# Altium schematic sheet Sensores_ADCs_Sheet.SchDoc: Sensores y ADCs
size 381 x 241 mm; Date: 13/10/2025; Author: Gerson T.& Lotfi D.; Organization: Universidad Distrital Francisco José de Caldas; DocumentNumber: 4; Revision: 1.0; SheetNumber: 4; SheetTotal: 5; Time: 19:25
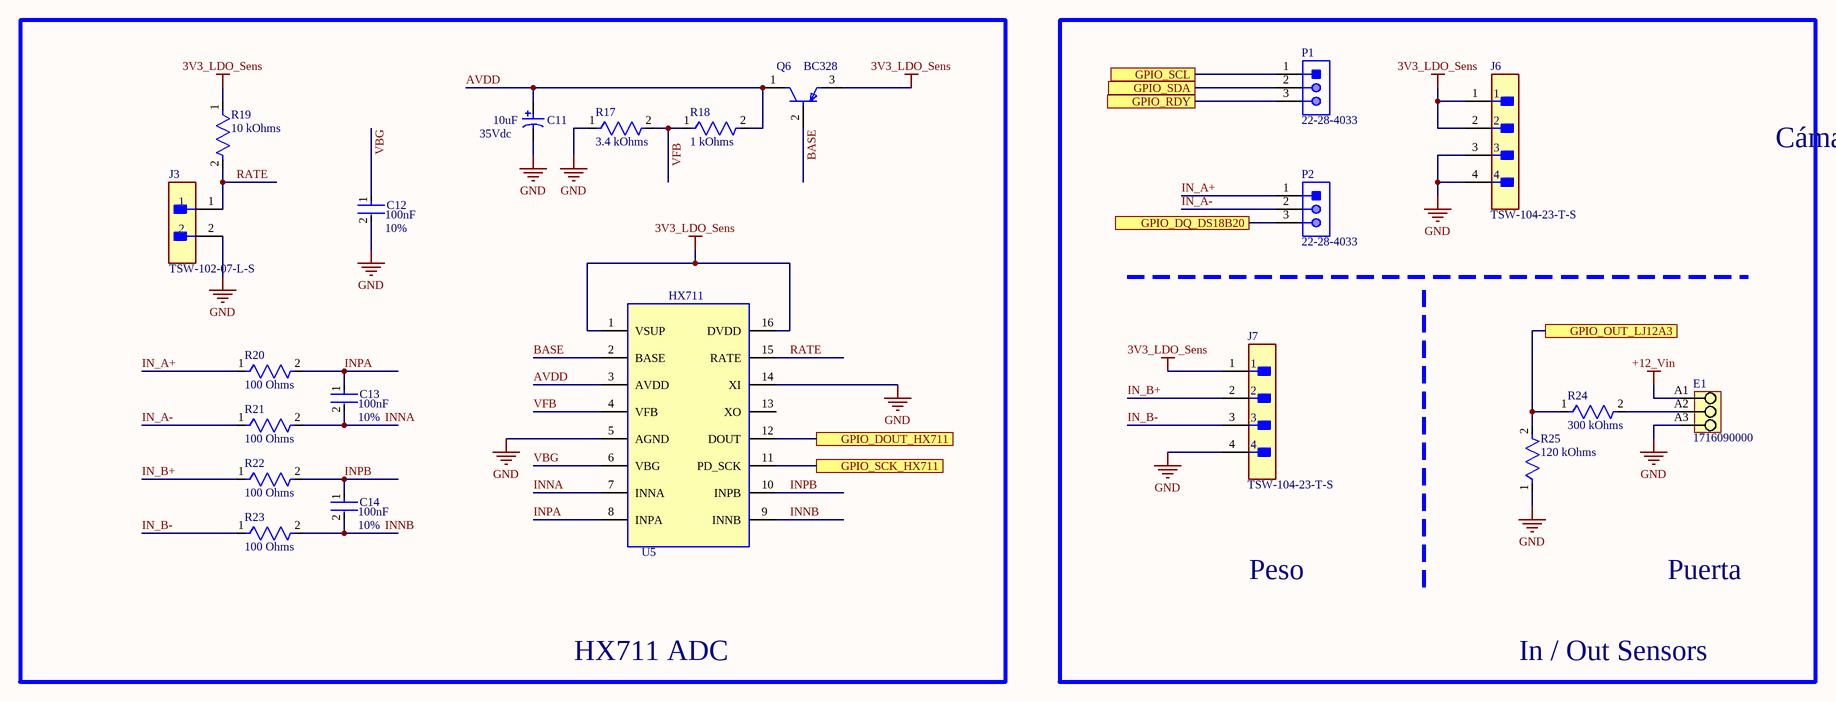
[diagram p0: Sensores_ADCs_Sheet.SchDoc]

## Parts
C11  Voltage: 35Vdc  Capacitance Value: 10uF  [KEMT-T352_E_V]  (hidden comment: T352E475K035AT)
C12  Tolerance: 10%  Capacitance: 100nF  [FP-RDE2M1-MFG]  (hidden comment: RDER72E104K2K1H03B)
C13  Tolerance: 10%  Capacitance: 100nF  [FP-RDE2M1-MFG]  (hidden comment: RDER72E104K2K1H03B)
C14  Tolerance: 10%  Capacitance: 100nF  [FP-RDE2M1-MFG]  (hidden comment: RDER72E104K2K1H03B)
E1  1716090000  [LM_5_08_90_03]
J3  TSW-102-07-L-S  [FP-TSW-102-07-L-S-MFG]
J6  TSW-104-23-T-S  [FP-TSW-104-23-T-S-MFG]
J7  TSW-104-23-T-S  [FP-TSW-104-23-T-S-MFG]
P1  22-28-4033  [MOLX-22-28-4033_V]
P2  22-28-4033  [MOLX-22-28-4033_V]
Q6  BC328  [TO-92]
R17  3.4 kOhms  [FP-FMP100-MFG]
R18  1 kOhms  [FP-FMP100-MFG]
R19  10 kOhms  [FP-FMP100-MFG]
R20  100 Ohms  [FP-FMP100-MFG]
R21  100 Ohms  [FP-FMP100-MFG]
R22  100 Ohms  [FP-FMP100-MFG]
R23  100 Ohms  [FP-FMP100-MFG]
R24  300 kOhms  [FP-FMP100-MFG]
R25  120 kOhms  [FP-FMP100-MFG]
U5  HX711  [SOP-16L (SOP127P600-8N)]

## Blocks framed on the sheet
HX711 ADC: C11-C14 J3 Q6 R17-R23 U5

## Ports
GPIO_DOUT_HX711 (see ESP32WROOM_Sheet[5A], ESP32WROOM_Sheet[5C]), GPIO_DQ_DS18B20 (see ESP32WROOM_Sheet[5A], ESP32WROOM_Sheet[5C]), GPIO_OUT_LJ12A3 (see ESP32WROOM_Sheet[5A], ESP32WROOM_Sheet[6C]), GPIO_RDY (see ESP32WROOM_Sheet[5B], ESP32WROOM_Sheet[5C]), GPIO_SCK_HX711 (see ESP32WROOM_Sheet[5B], ESP32WROOM_Sheet[5C]), GPIO_SCL (see ESP32WROOM_Sheet[5B], ESP32WROOM_Sheet[5D]), GPIO_SDA (see ESP32WROOM_Sheet[5B], ESP32WROOM_Sheet[5C])

## Nets
3V3_LDO_Sens: J6.1 J6.2 J7.1 Q6.3(C) R19.1 U5.1(VSUP) U5.16(DVDD)
+12_Vin: E1.A1
GND: C11.2 C12.2 E1.A3 J3.2 J6.3 J6.4 J7.4 R17.1 R25.1 U5.5(AGND) U5.14(XI)
AVDD: C11.1 Q6.1(E) R18.2 U5.3(AVDD)
BASE: Q6.2(B) U5.2(BASE)
GPIO_DOUT_HX711: U5.12(DOUT) ; port GPIO_DOUT_HX711
GPIO_DQ_DS18B20: P2.3 ; port GPIO_DQ_DS18B20
GPIO_OUT_LJ12A3: R24.1 R25.2 ; port GPIO_OUT_LJ12A3
GPIO_RDY: P1.3 ; port GPIO_RDY
GPIO_SCK_HX711: U5.11(PD_SCK) ; port GPIO_SCK_HX711
GPIO_SCL: P1.1 ; port GPIO_SCL
GPIO_SDA: P1.2 ; port GPIO_SDA
IN_A+: P2.1 R20.1
IN_A-: P2.2 R21.1
IN_B+: J7.2 R22.1
IN_B-: J7.3 R23.1
INNA: C13.2 R21.2 U5.7(INNA)
INNB: C14.2 R23.2 U5.9(INNB)
INPA: C13.1 R20.2 U5.8(INPA)
INPB: C14.1 R22.2 U5.10(INPB)
RATE: J3.1 R19.2 U5.15(RATE)
VBG: C12.1 U5.6(VBG)
VFB: R17.2 R18.1 U5.4(VFB)
NetE1_A2: E1.A2 R24.2

Not connected (* = marked no-connect by the designer): U5 13(XO)

## Notes on the sheet
- Cámara de gases
- Peso
- Puerta
- In / Out Sensors

## Library data of the parts
C11 = CMP-2000-07185-1: Capacitor, Tantalum, Radial, Solid Tantalum, Conformal, Dipped, 4.7 uF, +/- 10%, 35 V, -55 to 125 degC, 2-Pin THD (T352), RoHS, Bulk; Manufacturer: KEMET; Product Height: 11.7(Max)mm; Lead Pitch For Radial: 5.08mm; Product Diameter: 5.5(Max)mm; Voltage Rating DC: 35V; Package Description: 2-Pin Through Hole Device, Body 5.5 x 0.5 mm, Height 11.7 mm; Manufacturer URL: http://www.kemet.com/; Operating Temperature: -55to125°C; Packaging: Bulk; Category: CapacitorTantalumSolidRadial; Case Style: Dipped; PartNumber: T352E475K035AT; Maximum Operating Temperature: 125°C; Tolerance: 10%; Minimum Operating Temperature: -55°C; Mounting Technology: ThroughHole; Package Reference: T352; Datasheet Version: 05/2016; Datasheet URL: http://capacitoredge.kemet.com/capedge2/DataSheet/Datasheet-T352E475K035AT.pdf?pn=T352E475K035AT; Package URL: http://capacitoredge.kemet.com/capedge2/DataSheet/Datasheet-T352E475K035AT.pdf?pn=T352E475K035AT
C12-C14 = CMP-06035-020184-1: Ceramic Capacitor 100nF ±10% 250V X7R Radial; Lead/Base Style: Kinked; Lead Diameter: 0.5mm; Lead Pitch: 0.197inch; Dielectric: X7R; Mount: Through Hole; Resistor Type: Ceramic; Height: 4mm; Width: 0.124inch; Length: 5.5mm; Case/Package: Radial; Packaging: Bulk; Max Operating Temperature: 125°C; Voltage Rating (DC): 250V; Package Quantity: 500; Min Operating Temperature: -55°C; Voltage Rating: 250V; Termination: Radial; Height - Seated (Max): 0.236inch; Lead Free: Lead Free
E1 = CMP-1559-01768-1: OMNIMATE Signal - series LM; Manufacturer: Weidmueller; Contact_surface: tinned; Pitch_mm: 5,08 mm; Solder_pin_length_mm: 3,5 mm; Contact_material: Cu-Leg; Wire_cross_section_AWG_min_UL_1059: AWG 24; Solid_min_H05_07_V_U: 0,2 mm²; Insulating_material: Wemid (PA); Solid_max_H05_07_V_U: 2,5 mm²; Pitch_inch: 0,2 inch; Wire_cross_section_AWG_max_UL_1059: AWG 14; UL_94_flammability_rating: V-0; No_of_poles: 3; Rated_voltage_use_group_B_UL_1059: 300 V; Mounting_onto_the_PCB: Solder connection; Side_termination_characteristic: closed side; Short_text_for_material: LM 5.08/03/90 3.5SN OR BX; Rated_current_use_group_B_UL_1059: 15 A; Rated_voltage_for_surge_voltage_class_pollution_degree_II_2: 630 V; Revision: V1; ComponentLink2URL: http://catalog.weidmueller.com/catalog/Start.do?localeId=en&ObjectID=1716090000; Colour: Orange; PackageReference: LM_5_08_90_03; ComponentLink1Description: Manufacturer URL; ComponentLink2Description: URL Link1; ComponentLink1URL: http://www.weidmueller.com/; Qty: 500 PCS; PartNumber: 1716090000; Packaging: Box
J3 = CMP-02766-001428-1: CONN HEADER VERT 2POS 2.54MM; Voltage Rating: 550V; Current Rating: 7.6A; Gender: Male; Number of Contacts: 2; Connector Type: Male Pin; Radiation Hardening: No; Orientation: Straight; Contact Plating: Gold; Max Operating Temperature: 125°C; Mount: Through Hole; Package Quantity: 1; Number of Rows: 1; Housing Material: Polyester; RoHS Compliant: Yes; Length: 5.08mm; Max Voltage Rating (AC): 550V; Pitch: 2.54mm; Packaging: Bulk; Depth: 2.54mm; Termination: Solder; Min Operating Temperature: -55°C; Housing Color: Black; Lead Free: Lead Free; Color: Black; Number of Positions: 2; Width: 2.54mm; Max Current Rating: 7.6A; REACH SVHC: No SVHC; Contact Material: Bronze; Contact Mating Length: 0.23inch; Series: TSW; Contact Type: Male Pin
J6 J7 = CMP-02766-001388-1: CONN HEADER VERT 4POS 2.54MM; Number of Contacts: 4; Gender: Male; Connector Type: Male Pin; Max Voltage Rating (AC): 550V; Max Current Rating: 7.6A; Radiation Hardening: No; Lead Free: Lead Free; RoHS Compliant: Yes; Contact Material: Bronze; Number of Positions: 4; Housing Color: Black; Min Operating Temperature: -55°C; Mount: Through Hole; Number of Rows: 1; Orientation: Straight; Contact Mating Length: 0.23inch; Contact Type: Male Pin; REACH SVHC: No SVHC; Max Operating Temperature: 105°C; Color: Black; Pitch: 2.54mm; Length: 10.16mm; Series: TSW; Packaging: Bulk; Contact Plating: Tin; Package Quantity: 1; Termination: Solder; Housing Material: Polyester; Width: 2.54mm; Depth: 2.54mm
P1 P2 = CMP-1676-00001-5: Male Header, Pitch 2.54 mm, 1 x 3 Position, Height 8.38 mm, Tail Length 3.18 mm, RoHS, Bulk; Manufacturer: Molex; Rows: 1; Voltage Rating: 250 V; Current Rating: 4 A; Min Operating Temperature: 0 degC; Lead Pitch: 0.1 inch; Packaging: Bulk; Contact Finish: Gold; RoHSCompliant: true; Contact Material: Brass; PackageReference: 22-28-4033; REACH SVHC: Unknown; PackageDescription: Male Header, Pitch 2.54 mm, 1 x 3 Position, Height 8.38 mm, Tail Length 3.18 mm; ComponentLink2URL: http://www.molex.com/pdm_docs/sd/022284033_sd.pdf; Height: 8.38 mm; Mounting Technology: Through Hole; ComponentLink1Description: Manufacturer URL; Length: 7.62 mm; Mount: Through Hole; DatasheetVersion: Rev. G, 01/2012; Max Operating Temperature: 75 degC; ComponentLink2Description: Datasheet; Colour: Black; Pins: 3; Contact Plating: Gold; Package Quantity: 1; ComponentLink1URL: http://www.molex.com/
Q6 = BC328: Collector Base Voltage: - 30 V; Collector Emitter Voltage: - 25 V; Emitter Base Voltage: - 5 V; Collector Current: - 800 mA; Peak Collector Current: - 1 A; Total Power Dissipation: 625 mW; Junction Temperature: 150 °C; DC Current Gain: 100 - 630; Collector Base Cutoff Current: - 100 nA; Collector Emitter Saturation Voltage: - 0.7 V; Base Emitter On Voltage: - 1.2 V; Gain Bandwidth Product: 100 MH; Collector Base Capacitance: 12 pF; Storage Temperature Range: - 55 to + 150 °C; Collector Base Breakdown Voltage: - 30 V; Collector Emitter Breakdown Voltage: - 25 V; Emitter Base Breakdown Voltage: - 5 V; ComponentLink1Description: Suplier; ComponentLink1URL: https://co.mouser.com/ProductDetail/onsemi-Fairchild/BC328?qs=UMEuL5FsraCayeUWgO8mfw%3D%3D&srsltid=AfmBOorf5xZwroEOplrd7QqiXYxDeoimh0FrK1nMyUL-RBvrlmJFWC5R; ComponentLink2Description: Datasheet (1); ComponentLink2URL: https://www.mouser.com/catalog/specsheets/fairchild%20semiconductor_bc327.pdf?_gl=1*1ayinll*_gcl_au*MTU3NTQyMTg3NS4xNzU3MzcyNzA1LjE4NDA3OTc0MTAuMTc2MDM4ODMxNC4xNzYwMzg4NDM1*_ga*MTE1MjgxNTUzOS4xNzU3MzcyNzA3*_ga_15W4STQT4T*czE3NjAzOTI0MjgkbzEyJGcxJHQxNzYwMzkzNzQyJGo2MCRsMCRoMA..; ComponentLink3Description: datasheet (2); ComponentLink3URL: https://www.alldatasheet.es/datasheet-pdf/view/281199/SEMTECH_ELEC/BC328.html
R17-R25 = CMP-00621-25629781-1: Resistor, 1 kOhm, ± 5%, 1 W, Axial Leaded, Metal Film, High Power Flame Proof; Power Rating: 1W; Resistance: 1kΩ; Temperature Coefficient: 100ppm/°C; Length: 6.3mm; Min Operating Temperature: -55°C; Tolerance: 5%; RoHS: Compliant; Military Standard: Not; Mount: Through Hole; Case/Package: Conformal; Diameter: 2.4mm; Schedule B: 8533210090, 8533210090; Radiation Hardening: No; Lead Free: Lead Free; Composition: Metal Film; Max Operating Temperature: 155°C; Termination: Axial
U5 = HX711: differential input channels: Two selectable; PGA with selectable gain: 32, 64 and 128 8On-chip active low noise ); Full scale differential input range: ±0.5(AVDD/GAIN)V; Common mode input: AGND+1.2 - AVDD-1.3 V; Output data rate: 10, 80 Hz; Output data coding: 2’s complement (800000 - 7FFFFF HEX); Output settling time (RATE = 0): 400 ms; Output settling time (RATE = DVDD): 50 ms; Input offset drift (Gain = 128): 0.2 mV; Input offset drift (Gain = 64): 0.4 mV; Input noise (Gain = 128，RATE = 0): 50 nV (rms); Input noise (Gain = 128，RATE = DVDD): 90 nV (rms); Temperature drift (Input offset[Gain = 128]): ±6 nV/°C; Temperature drift (Gain [Gain = 128]): ±5 nV/°C; Input common mode rejection (Gain = 128，RATE = 0): 100 dB; Reference bypass: 1.25 V; Crystal or external clock frequency: 1 - 20 (typ 11.0592) MHz; Power supply voltage (DVDD, AVDD, VSUP): 2.6 - 5.5 V; Analog supply current (including regulator): Normal 1400 uA; Power down 0.3 uA; Digital supply current: Normal 100 uA; Power down 0.2 uA; supply rejection: Simultaneous 50 and 60Hz; Operation temperature range: -40 ~ +85°C; Power supply rejection (Gain = 128，RATE = 0): 100 dB; ComponentLink1Description: Suplier; ComponentLink1URL: https://www.lcsc.com/product-detail/C6705483.html?s_z=n_hx711; ComponentLink2Description: datasheet; ComponentLink2URL: https://www.lcsc.com/datasheet/C6705483.pdf